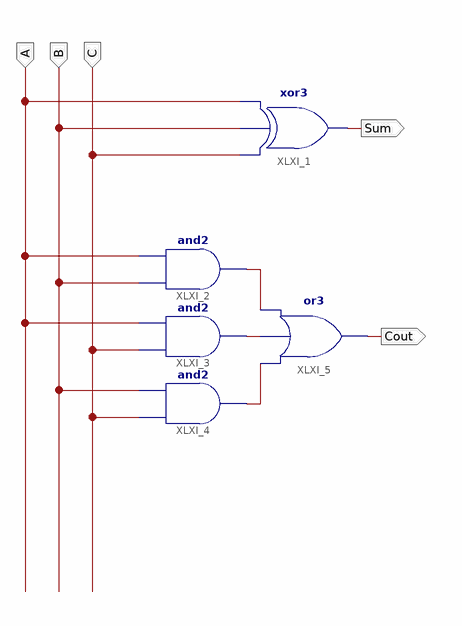
[diagram p0: schematic sheet 1]
// Xilinx ISE schematic lab1.sch (spartan6) as structural Verilog: 5 symbols, 5 ports
module lab1 (
  input  A,
  input  B,
  input  C,
  output Sum,
  output Cout
);

  wire XLXN_5, XLXN_6, XLXN_7;

  xor XLXI_1 (Sum, C, B, A);
  and XLXI_2 (XLXN_6, B, A);
  and XLXI_3 (XLXN_5, C, A);
  and XLXI_4 (XLXN_7, C, B);
  or XLXI_5 (Cout, XLXN_7, XLXN_5, XLXN_6);
endmodule
